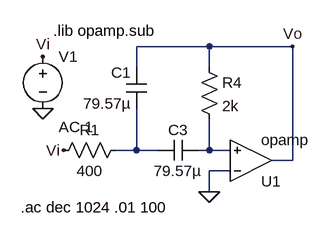
[diagram p0: schematic Draft1.asc]
Draft1.asc, the LTspice schematic file:
Version 4
SHEET 1 880 680
WIRE 144 -16 32 -16
WIRE 272 -16 144 -16
WIRE 32 16 32 -16
WIRE 144 16 144 -16
WIRE 32 144 32 80
WIRE 32 144 0 144
WIRE 64 144 32 144
WIRE 144 144 144 96
WIRE 144 144 128 144
WIRE 176 144 144 144
WIRE 272 160 272 -16
WIRE 272 160 240 160
WIRE 176 176 144 176
WIRE 144 208 144 176
FLAG 144 208 0
FLAG -80 144 Vi
FLAG 272 -16 Vo
FLAG -112 80 0
FLAG -112 0 Vi
SYMBOL OpAmps\\opamp 208 224 M180
SYMATTR InstName U1
SYMBOL res 16 128 R90
WINDOW 0 0 56 VBottom 2
WINDOW 3 32 56 VTop 2
SYMATTR InstName R1
SYMATTR Value 400
SYMBOL cap 128 128 R90
WINDOW 0 0 32 VBottom 2
WINDOW 3 32 32 VTop 2
SYMATTR InstName C3
SYMATTR Value 79.57µ
SYMBOL cap 48 80 R180
WINDOW 0 24 56 Left 2
WINDOW 3 24 8 Left 2
SYMATTR InstName C1
SYMATTR Value 79.57µ
SYMBOL res 128 0 R0
SYMATTR InstName R4
SYMATTR Value 2k
SYMBOL voltage -112 -16 R0
WINDOW 123 24 124 Left 2
WINDOW 39 0 0 Left 0
SYMATTR InstName V1
SYMATTR Value ""
SYMATTR Value2 AC 1
TEXT -96 -40 Left 2 !.lib opamp.sub
TEXT -146 232 Left 2 !.ac dec 1024 .01 100

The netlist it stands for:
* Draft1.asc
XU1 0 N002 Vo opamp Aol=100K GBW=10Meg  ; pins invin noninvin out
R1 N001 Vi 400
C3 N002 N001 79.57µ
C1 N001 Vo 79.57µ
R4 Vo N002 2k
V1 Vi 0 AC 1
.lib opamp.sub
.ac dec 1024 .01 100
.backanno
.end